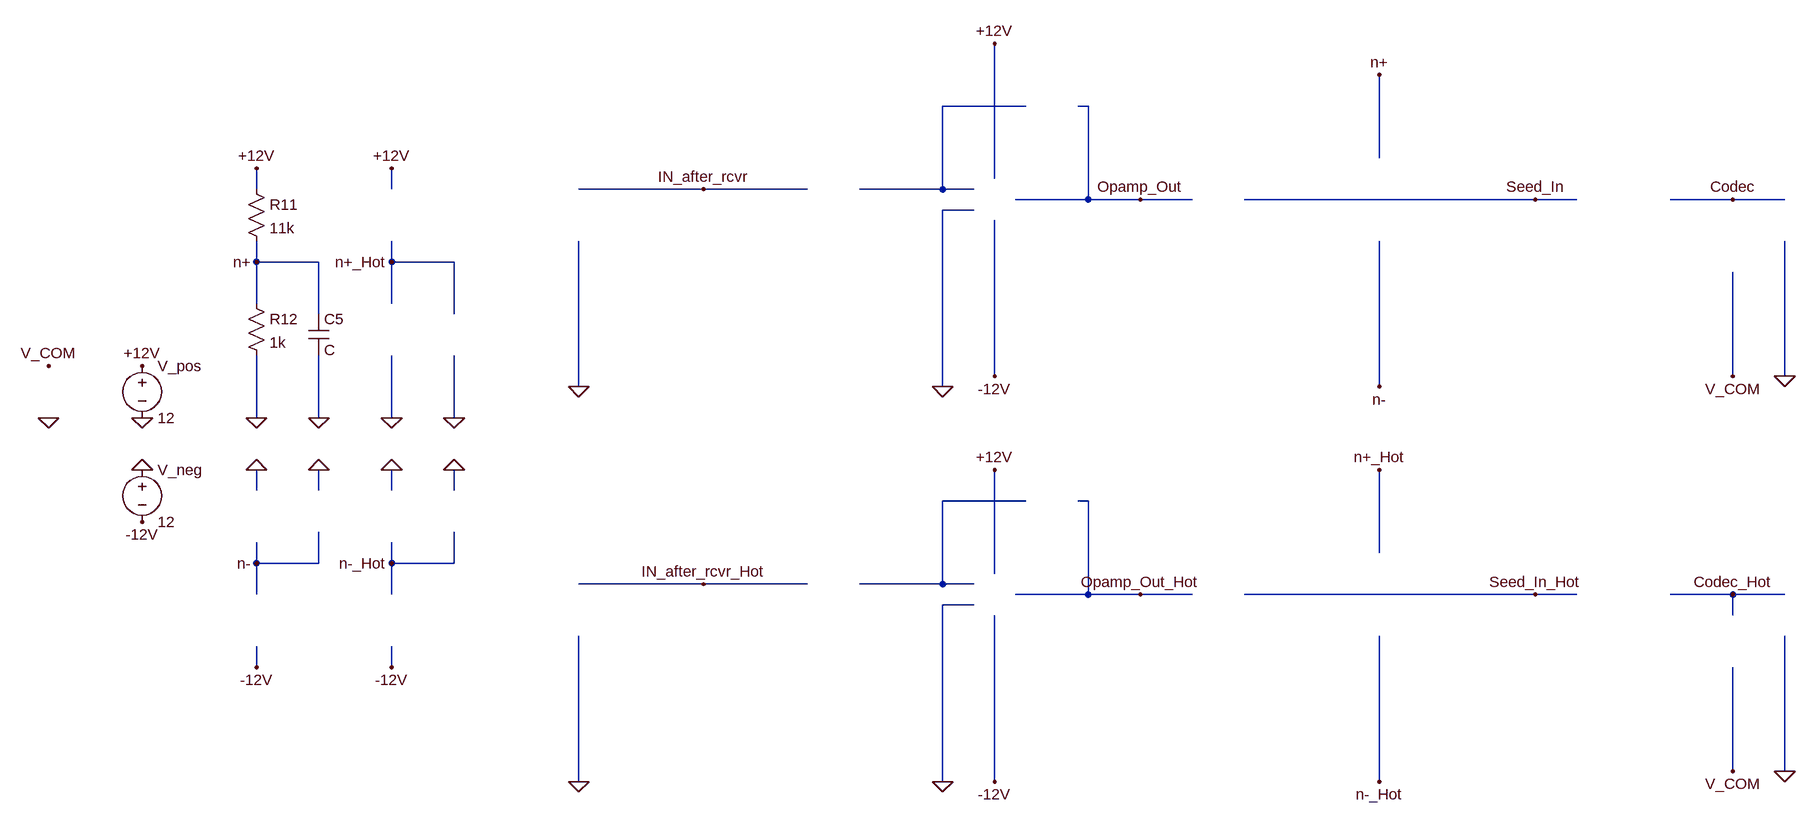
[diagram p0: schematic .!55486!Input-sim.asc]
.!55486!Input-sim.asc, the LTspice schematic file:
Version 4
SHEET 1 2400 1800
WIRE 416 496 288 496
WIRE 512 496 496 496
WIRE 960 576 960 448
WIRE 368 608 368 400
WIRE -768 624 -768 592
WIRE -560 624 -560 592
WIRE -80 624 -272 624
WIRE 80 624 -80 624
WIRE 288 624 288 496
WIRE 288 624 160 624
WIRE 336 624 288 624
WIRE 512 640 512 496
WIRE 512 640 400 640
WIRE 592 640 512 640
WIRE 672 640 592 640
WIRE 960 640 752 640
WIRE 1200 640 960 640
WIRE 1264 640 1200 640
WIRE 1504 640 1408 640
WIRE 1584 640 1504 640
WIRE 336 656 288 656
WIRE -768 736 -768 704
WIRE -672 736 -768 736
WIRE -560 736 -560 704
WIRE -464 736 -560 736
WIRE -768 800 -768 736
WIRE -560 800 -560 736
WIRE -672 816 -672 736
WIRE -464 816 -464 736
WIRE 368 912 368 672
WIRE 1504 912 1504 752
WIRE 1584 912 1584 704
WIRE -272 928 -272 704
WIRE 288 928 288 656
WIRE 960 928 960 704
WIRE -768 976 -768 880
WIRE -672 976 -672 880
WIRE -560 976 -560 880
WIRE -464 976 -464 880
WIRE -768 1088 -768 1056
WIRE -672 1088 -672 1056
WIRE -560 1088 -560 1056
WIRE -464 1088 -464 1056
WIRE 416 1104 288 1104
WIRE 512 1104 496 1104
WIRE 960 1184 960 1056
WIRE -768 1200 -768 1168
WIRE -672 1200 -672 1152
WIRE -672 1200 -768 1200
WIRE -560 1200 -560 1168
WIRE -464 1200 -464 1152
WIRE -464 1200 -560 1200
WIRE 368 1216 368 1056
WIRE -80 1232 -272 1232
WIRE 80 1232 -80 1232
WIRE 288 1232 288 1104
WIRE 288 1232 160 1232
WIRE 336 1232 288 1232
WIRE -768 1248 -768 1200
WIRE -560 1248 -560 1200
WIRE 512 1248 512 1104
WIRE 512 1248 400 1248
WIRE 592 1248 512 1248
WIRE 672 1248 592 1248
WIRE 960 1248 752 1248
WIRE 1200 1248 960 1248
WIRE 1264 1248 1200 1248
WIRE 1504 1248 1408 1248
WIRE 1584 1248 1504 1248
WIRE 336 1264 288 1264
WIRE 1504 1280 1504 1248
WIRE -768 1360 -768 1328
WIRE -560 1360 -560 1328
WIRE 1504 1520 1504 1360
WIRE 1584 1520 1584 1312
WIRE -272 1536 -272 1312
WIRE 288 1536 288 1264
WIRE 368 1536 368 1280
WIRE 960 1536 960 1312
FLAG -944 896 +12V
FLAG -944 976 0
FLAG -944 1056 0
FLAG -944 1136 -12V
FLAG -768 592 +12V
FLAG -768 736 n+
FLAG -768 976 0
FLAG -672 976 0
FLAG -768 1056 0
FLAG -768 1200 n-
FLAG -768 1360 -12V
FLAG -672 1056 0
FLAG -1088 896 V_COM
FLAG -1088 976 0
FLAG -272 928 0
FLAG -80 624 IN_after_rcvr
FLAG 288 928 0
FLAG 368 400 +12V
FLAG 368 912 -12V
FLAG 592 640 Opamp_Out
FLAG 1200 640 Seed_In
FLAG 960 448 n+
FLAG 960 928 n-
FLAG 1504 640 Codec
FLAG 1504 912 V_COM
FLAG 1584 912 0
FLAG -272 1536 0
FLAG -80 1232 IN_after_rcvr_Hot
FLAG 288 1536 0
FLAG 368 1056 +12V
FLAG 368 1536 -12V
FLAG 592 1248 Opamp_Out_Hot
FLAG 1200 1248 Seed_In_Hot
FLAG 960 1056 n+_Hot
FLAG 960 1536 n-_Hot
FLAG 1504 1248 Codec_Hot
FLAG 1504 1520 V_COM
FLAG 1584 1520 0
FLAG -560 592 +12V
FLAG -560 736 n+_Hot
FLAG -560 976 0
FLAG -464 976 0
FLAG -560 1056 0
FLAG -560 1200 n-_Hot
FLAG -560 1360 -12V
FLAG -464 1056 0
SYMBOL voltage -944 880 R0
SYMATTR InstName V_pos
SYMATTR Value 12
SYMBOL voltage -944 1040 R0
SYMATTR InstName V_neg
SYMATTR Value 12
SYMBOL res -784 608 R0
SYMATTR InstName R11
SYMATTR Value 11k
SYMBOL res -784 784 R0
SYMATTR InstName R12
SYMATTR Value 1k
SYMBOL cap -688 816 R0
SYMATTR InstName C5

The netlist it stands for:
* .!55486!Input-sim.asc
V_pos +12V 0 12
V_neg 0 -12V 12
R11 +12V n+ 11k
R12 n+ 0 1k
C5 n+ 0 C
.backanno
.end